# Altium schematic sheet MIN-PCIE.SchDoc
size A4
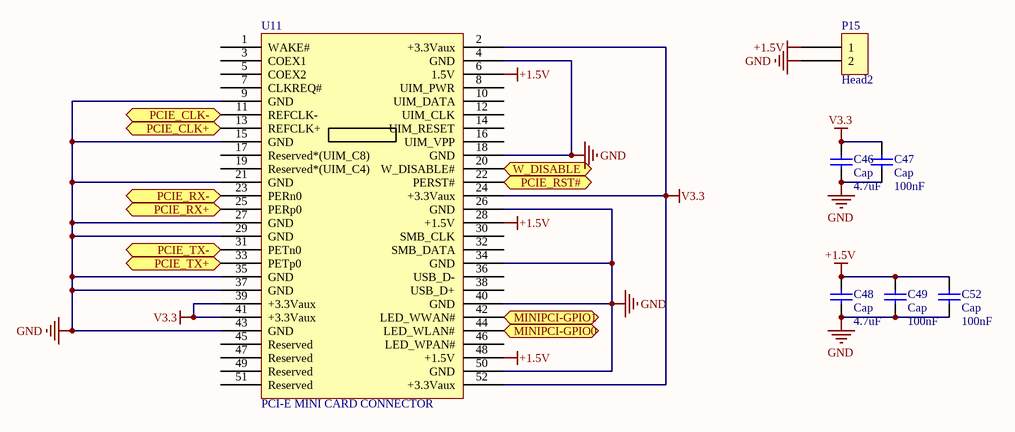
[diagram p0: MIN-PCIE.SchDoc]

## Parts
C46  Cap  value 4.7uF  [R0603N]
C47  Cap  value 100nF  [R0603N]
C48  Cap  value 4.7uF  [R0603N]
C49  Cap  value 100nF  [R0603N]
C52  Cap  value 100nF  [R0603N]
P15  Head2  [HDR1X2]
U11  PCI-E MINI CARD CONNECTOR  [MC2716]

## Ports
MINIPCI-GPIO0, MINIPCI-GPIO1, PCIE_CLK+, PCIE_CLK-, PCIE_RST#, PCIE_RX+, PCIE_RX-, PCIE_TX+, PCIE_TX-, W_DISABLE

## Nets
+1.5V: C48.2 C49.2 C52.2 P15.1 U11.6(1.5V) U11.28(+1.5V) U11.48(+1.5V)
GND: C46.1 C47.1 C48.1 C49.1 C52.1 P15.2 U11.4(GND) U11.9(GND) U11.15(GND) U11.18(GND) U11.21(GND) U11.26(GND) U11.27(GND) U11.29(GND) U11.34(GND) U11.35(GND) U11.37(GND) U11.40(GND) U11.43(GND) U11.50(GND)
V3.3: C46.2 C47.2 U11.2(+3.3Vaux) U11.24(+3.3Vaux) U11.39(+3.3Vaux) U11.41(+3.3Vaux) U11.52(+3.3Vaux)
MINIPCI-GPIO0: U11.44(LED_WLAN#) ; port MINIPCI-GPIO0
MINIPCI-GPIO1: U11.42(LED_WWAN#) ; port MINIPCI-GPIO1
PCIE_CLK+: U11.13(REFCLK+) ; port PCIE_CLK+
PCIE_CLK-: U11.11(REFCLK-) ; port PCIE_CLK-
PCIE_RST#: U11.22(PERST#) ; port PCIE_RST#
PCIE_RX+: U11.25(PERp0) ; port PCIE_RX+
PCIE_RX-: U11.23(PERn0) ; port PCIE_RX-
PCIE_TX+: U11.33(PETp0) ; port PCIE_TX+
PCIE_TX-: U11.31(PETn0) ; port PCIE_TX-
W_DISABLE: U11.20(W_DISABLE#) ; port W_DISABLE

Not connected (* = marked no-connect by the designer): U11 1(WAKE#) 3(COEX1) 5(COEX2) 7(CLKREQ#) 8(UIM_PWR) 10(UIM_DATA) 12(UIM_CLK) 14(UIM_RESET) 16(UIM_VPP) 17(Reserved*(UIM_C8)) 19(Reserved*(UIM_C4)) 30(SMB_CLK) 32(SMB_DATA) 36(USB_D-) 38(USB_D+) 45(Reserved) 46(LED_WPAN#) 47(Reserved) 49(Reserved) 51(Reserved)

## Library data of the parts
C46-C49 C52 = Cap: Capacitor; Published: 8-Jun-2000; LatestRevisionDate: 17-Jul-2002; LatestRevisionNote: Re-released for DXP Platform.; PackageReference: RAD-0.3; Publisher: Altium Limited